# EAGLE design joyAnalog (EAGLE 7.7.0)
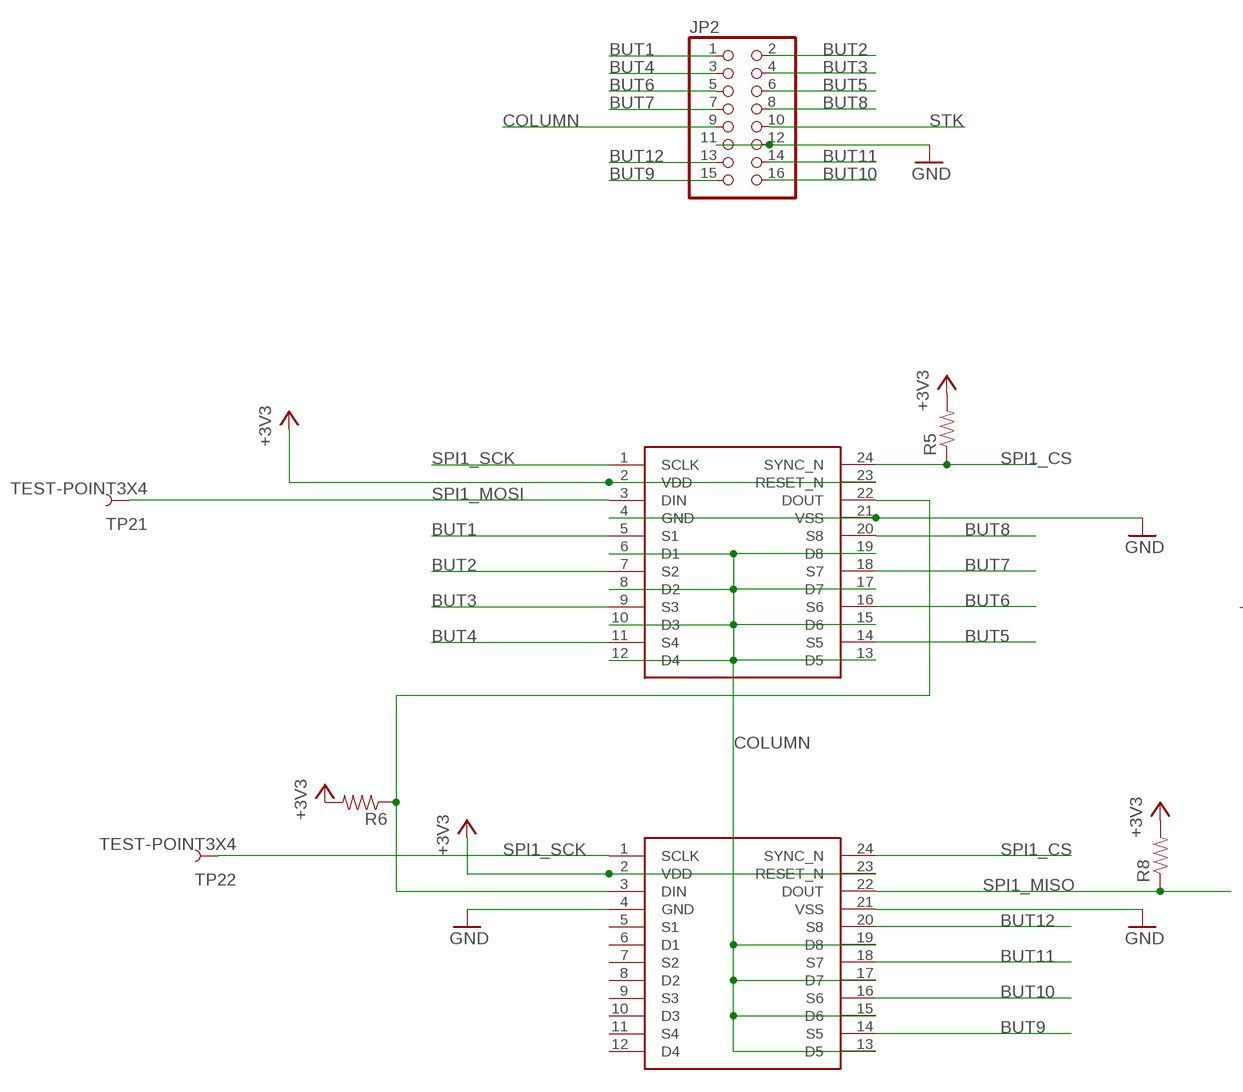
[diagram p0: schematic, sheet 1, part 1 of 2]
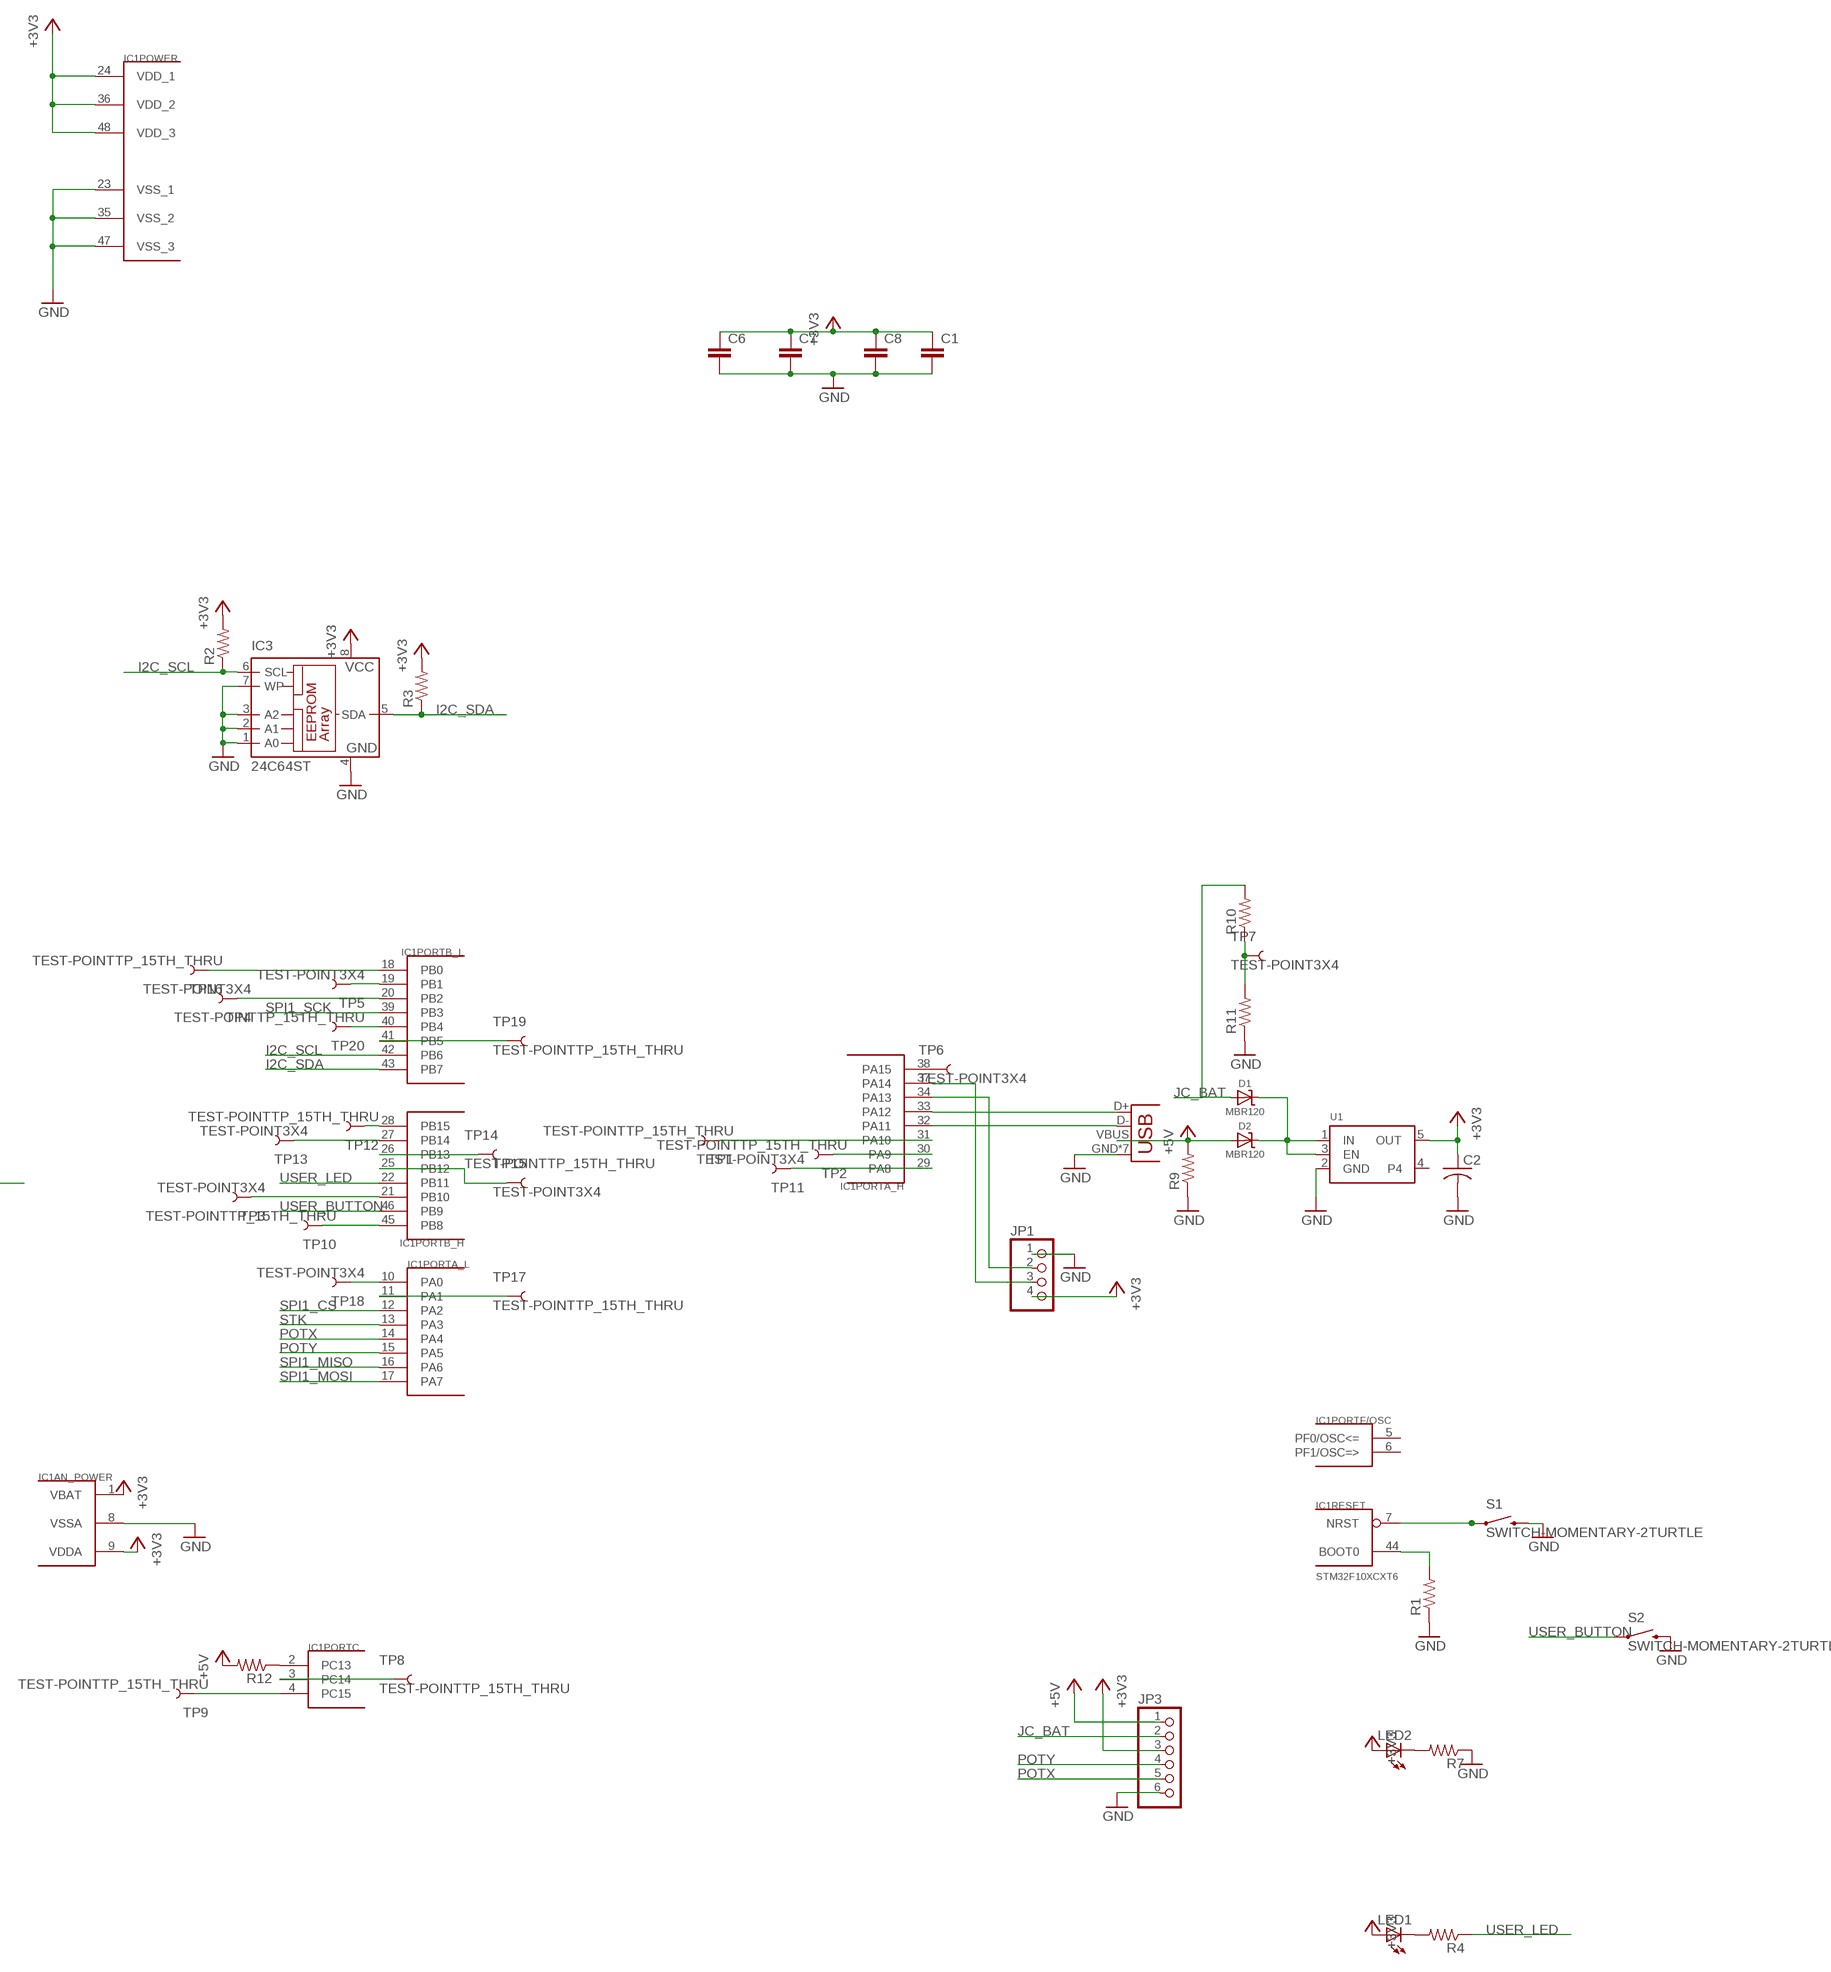
[diagram p1: schematic, sheet 1, part 2 of 2]

## Parts
C1  CAP0805  [0805]
C2  C-USC1210  [C1210]
C6  CAP0805  [0805]
C7  CAP0805  [0805]
C8  CAP0805  [0805]
D1  MBR120  DIODE-SCHOTTKYSOD-123  [SOD-123]
D2  MBR120  DIODE-SCHOTTKYSOD-123  [SOD-123]
IC1  STM32F10XCXT6  [TQFP48]
IC3  24C64ST  [TSSOP8]
JP1  PINHD-1X4  [1X04]
JP2  PINHD-2X8  [2X08]
JP3  PINHD-1X6CB  [1X06-CLEANBIG]
LED1  LEDCHIP-LED0805  [CHIP-LED0805]
LED2  LEDCHIP-LED0805  [CHIP-LED0805]
R1  RESISTOR0805-RES  [0805]
R2  RESISTOR0805-RES  [0805]
R3  RESISTOR0805-RES  [0805]
R4  RESISTOR0805-RES  [0805]
R5  RESISTOR0805-RES  [0805]
R6  RESISTOR0805-RES  [0805]
R7  RESISTOR0805-RES  [0805]
R8  RESISTOR0805-RES  [0805]
R9  RESISTOR0805-RES  [0805]
R10  RESISTOR0805-RES  [0805]
R11  RESISTOR0805-RES  [0805]
R12  RESISTOR0805-RES  [0805]
S1  SWITCH-MOMENTARY-2TURTLE  [KMR2]
S2  SWITCH-MOMENTARY-2TURTLE  [KMR2]
TP1  TEST-POINTTP_15TH_THRU  [TP_15TH]
TP2  TEST-POINTTP_15TH_THRU  [TP_15TH]
TP3  TEST-POINT3X4  [PAD.03X.04]
TP4  TEST-POINT3X4  [PAD.03X.04]
TP5  TEST-POINT3X4  [PAD.03X.04]
TP6  TEST-POINT3X4  [PAD.03X.04]
TP7  TEST-POINT3X4  [PAD.03X.04]
TP8  TEST-POINTTP_15TH_THRU  [TP_15TH]
TP9  TEST-POINTTP_15TH_THRU  [TP_15TH]
TP10  TEST-POINTTP_15TH_THRU  [TP_15TH]
TP11  TEST-POINT3X4  [PAD.03X.04]
TP12  TEST-POINTTP_15TH_THRU  [TP_15TH]
TP13  TEST-POINT3X4  [PAD.03X.04]
TP14  TEST-POINTTP_15TH_THRU  [TP_15TH]
TP15  TEST-POINT3X4  [PAD.03X.04]
TP16  TEST-POINTTP_15TH_THRU  [TP_15TH]
TP17  TEST-POINTTP_15TH_THRU  [TP_15TH]
TP18  TEST-POINT3X4  [PAD.03X.04]
TP19  TEST-POINTTP_15TH_THRU  [TP_15TH]
TP20  TEST-POINTTP_15TH_THRU  [TP_15TH]
TP21  TEST-POINT3X4  [PAD.03X.04]
TP22  TEST-POINT3X4  [PAD.03X.04]
U1  VREG_SOT23-5  [SOT23-5]
U$3  ADG714_DEV  [TSSOP-24]
U$4  ADG714_DEV  [TSSOP-24]
X1  USB-MICROB  [USB-MICROB]

## Nets
+3V3: C1.1 C2.1 C6.1 C7.1 C8.1 IC1.1(AN_POWER:VBAT) IC1.9(AN_POWER:VDDA) IC1.24(POWER:VDD_1) IC1.36(POWER:VDD_2) IC1.48(POWER:VDD_3) IC3.8(VCC) JP1.4 JP3.3 LED1.A LED2.A R2.2 R3.2 R5.2 R6.2 R8.2 U1.5(OUT) U$3.2(VDD) U$3.23(RESET_N) U$4.2(VDD) U$4.23(RESET_N)
+5V: D2.A JP3.1 R9.2 R12.2 X1.VBUS
BUT1: JP2.1 U$3.5(S1)
BUT2: JP2.2 U$3.7(S2)
BUT3: JP2.4 U$3.9(S3)
BUT4: JP2.3 U$3.11(S4)
BUT5: JP2.6 U$3.14(S5)
BUT6: JP2.5 U$3.16(S6)
BUT7: JP2.7 U$3.18(S7)
BUT8: JP2.8 U$3.20(S8)
BUT9: JP2.15 U$4.14(S5)
BUT10: JP2.16 U$4.16(S6)
BUT11: JP2.14 U$4.18(S7)
BUT12: JP2.13 U$4.20(S8)
COLUMN: JP2.9 U$3.6(D1) U$3.8(D2) U$3.10(D3) U$3.12(D4) U$3.13(D5) U$3.15(D6) U$3.17(D7) U$3.19(D8) U$4.13(D5) U$4.15(D6) U$4.17(D7) U$4.19(D8)
GND: C1.2 C2.2 C6.2 C7.2 C8.2 IC1.8(AN_POWER:VSSA) IC1.23(POWER:VSS_1) IC1.35(POWER:VSS_2) IC1.47(POWER:VSS_3) IC3.1(A0) IC3.2(A1) IC3.3(A2) IC3.4(GND) IC3.7(WP) JP1.1 JP2.11 JP2.12 JP3.6 R1.1 R7.1 R9.1 R11.1 S1.3 S2.3 U1.2(GND) U$3.4(GND) U$3.21(VSS) U$4.4(GND) U$4.21(VSS) X1.GND X1.P1(GND) X1.P2(GND) X1.P3(GND) X1.P4(GND) X1.P5(GND) X1.P6(GND)
I2C_SCL: IC1.42(PORTB_L:PB6) IC3.6(SCL) R2.1
I2C_SDA: IC1.43(PORTB_L:PB7) IC3.5(SDA) R3.1
JC_BAT: D1.A JP3.2 R10.2
N$1: IC1.7(RESET:NRST) S1.1
N$2: IC1.44(RESET:BOOT0) R1.2
N$3: LED1.C R4.2
N$4: IC1.33(PORTA_H:PA12) X1.D+
N$5: R6.1 U$3.22(DOUT) U$4.3(DIN)
N$6: IC1.30(PORTA_H:PA9) TP2.P$1
N$7: IC1.32(PORTA_H:PA11) X1.D-
N$8: IC1.34(PORTA_H:PA13) JP1.2
N$9: IC1.37(PORTA_H:PA14) JP1.3
N$10: IC1.31(PORTA_H:PA10) TP1.P$1
N$11: IC1.20(PORTB_L:PB2) TP4.P$1
N$12: IC1.19(PORTB_L:PB1) TP5.P$1
N$13: IC1.21(PORTB_H:PB10) TP3.P$1
N$14: IC1.38(PORTA_H:PA15) TP6.P$1
N$15: R10.1 R11.2 TP7.P$1
N$16: IC1.3(PORTC:PC14) TP8.P$1
N$17: IC1.4(PORTC:PC15) TP9.P$1
N$18: IC1.45(PORTB_H:PB8) TP10.P$1
N$19: IC1.29(PORTA_H:PA8) TP11.P$1
N$20: IC1.28(PORTB_H:PB15) TP12.P$1
N$21: IC1.27(PORTB_H:PB14) TP13.P$1
N$22: IC1.26(PORTB_H:PB13) TP14.P$1
N$23: IC1.25(PORTB_H:PB12) TP15.P$1
N$24: IC1.18(PORTB_L:PB0) TP16.P$1
N$25: IC1.10(PORTA_L:PA0) TP18.P$1
N$26: IC1.11(PORTA_L:PA1) TP17.P$1
N$27: IC1.40(PORTB_L:PB4) TP20.P$1
N$28: IC1.41(PORTB_L:PB5) TP19.P$1
N$29: LED2.C R7.2
N$30: IC1.2(PORTC:PC13) R12.1
N$31: D1.C D2.C U1.1(IN) U1.3(EN)
POTX: IC1.14(PORTA_L:PA4) JP3.5
POTY: IC1.15(PORTA_L:PA5) JP3.4
SPI1_CS: IC1.12(PORTA_L:PA2) R5.1 U$3.24(SYNC_N) U$4.24(SYNC_N)
SPI1_MISO: IC1.16(PORTA_L:PA6) R8.1 U$4.22(DOUT)
SPI1_MOSI: IC1.17(PORTA_L:PA7) TP21.P$1 U$3.3(DIN)
SPI1_SCK: IC1.39(PORTB_L:PB3) TP22.P$1 U$3.1(SCLK) U$4.1(SCLK)
STK: IC1.13(PORTA_L:PA3) JP2.10
USER_BUTTON: IC1.46(PORTB_H:PB9) S2.1
USER_LED: IC1.22(PORTB_H:PB11) R4.1
Unconnected: IC1.5(PORTF/OSC:PF0/OSC<=) IC1.6(PORTF/OSC:PF1/OSC=>) U1.4 U$4.5(S1) U$4.6(D1) U$4.7(S2) U$4.8(D2) U$4.9(S3) U$4.10(D3) U$4.11(S4) U$4.12(D4)

## Library data of the parts
C1 C6-C8 = backplane:CAP: Capacitor Standard 0603 ceramic capacitor, and 0.1" leaded capacitor.
C2 = backplane:C-US: CAPACITOR, American symbol
D1 D2 = microbuilder:DIODE-SCHOTTKY
IC1 = stm32f072c8t6:STM32F10XCXT6: ST STM32F101/103 48pin LQFP
IC3 = microchip:24*: Serial EEPROM I2C; MPN: CAT24C64YI-GT3; OC_FARNELL: 1718133; OC_NEWARK: 08R5418
JP1 = pinhead:PINHD-1X4: PIN HEADER
JP2 = pinheadwerew:PINHD-2X8: PIN HEADER
JP3 = adafruit:PINHD-1X6: PIN HEADER
LED1 LED2 = adafruit:LED: LED OSRAM: - CHIPLED LG R971, LG N971, LY N971, LG Q971, LY Q971, LO R971, LY R971 LH N974, LH R974 LS Q976, LO Q976, LY Q976 LO Q996 - Hyper CHIPLED LW Q18S LB Q993, LB Q99A, LB R99A - SideLED LS A670, LO A670, LY A670, LG A670, LP A670 LB A673, LV A673, LT A673, LW A673 LH A674 LY A675 LS A676, LA A676, LO A676, LY A676, LW A676 LS A679, LY A679, LG A679 - Hyper Micro SIDELED® LS Y876, LA Y876, LO Y876, LY Y876 LT Y87S - SmartLED LW L88C, LW L88S LB L89C, LB L89S, LG L890 LS L89K, LO L89K, LY L89K LS L896, LA L896, LO L896, LY L896 - TOPLED LS T670, LO T670, LY T670, LG T670, LP T670 LSG T670, LSP T670, LSY T670, LOP T670, LYG T670 LG T671, LOG T671, LSG T671 LB T673, LV T673, LT T673, LW T673 LH T674 LS T676, LA T676, LO T676, LY T676, LB T676, LH T676, LSB T676, LW T676 LB T67C, LV T67C, LT T67C, LS T67K, LO T67K, LY T67K, LW E67C LS E67B, LA E67B, LO E67B, LY E67B, LB E67C, LV E67C, LT E67C LW T67C LS T679, LY T679, LG T679 LS T770, LO T770, LY T770, LG T770, LP T770 LB T773, LV T773, LT T773, LW T773 LH T774 LS E675, LA E675, LY E675, LS T675 LS T776, LA T776, LO T776, LY T776, LB T776 LHGB T686 LT T68C, LB T68C - Hyper Mini TOPLED® LB M676 - Mini TOPLED Santana® LG M470 LS M47K, LO M47K, LY M47K Source: http://www.osram.convergy.de/
R1-R12 = SparkFun-Passives:RESISTOR: Resistor Basic schematic elements and footprints for 0603, 1206, and PTH resistors.
S1 S2 = Adafruit Feather M0 Adalogger:SWITCH-MOMENTARY-2: Various NO switches- pushbuttons, reed, etc
TP1 TP2 TP8-TP10 TP12 TP14 TP16 TP17 TP19 TP20 = pth testpoint:TEST-POINT: SparkFun Test Points Bare copper test points for troubleshooting or In-Circuit-Testing. These are used by our Production team for verifying production board runs using pogo-pins on test beds. SparkFun Products: SparkFun LSM9DS1 Breakout <https://www.sparkfun.com/products/13284> SparkFun PSOC <https://www.sparkfun.com/products/13714> SparkFun Load Cell Amplifier <https://www.sparkfun.com/products/13879>
TP3-TP7 TP11 TP13 TP15 TP18 TP21 TP22 = SparkFun-Connectors:TEST-POINT: SparkFun Test Points Bare copper test points for troubleshooting or In-Circuit-Testing. These are used by our Production team for verifying production board runs using pogo-pins on test beds. SparkFun Products: SparkFun LSM9DS1 Breakout <https://www.sparkfun.com/products/13284> SparkFun PSOC <https://www.sparkfun.com/products/13714> SparkFun Load Cell Amplifier <https://www.sparkfun.com/products/13879>
U1 = Adafruit Feather M0 Adalogger:VREG_SOT23-5: SOT23-5 Fixed Voltage Regulators Part Current Out V Out V In V Dropout ?JA (°C/W) TJ (°C) Digikey Part No. ADP121 150mA 3.3V 3.4-5.5V 0.09V @ 150mA -- -- ADP121-AUJZ33R7CT-ND ADP121 150mA 3.0V 3.1-5.5V 0.09V @ 150mA -- -- ADP121-AUJZ30R7CT-ND ADP122 300mA 3.3V 3.4-5.5V 0.085V @ 300mA -- -- ADP122AUJZ-3.3-R7CT-ND ADP1712 300mA 3.3V 3.5-5.5V 0.17V @ 300mA -- -- ADP1712AUJZ-3.3-R7TR-ND AP7311 (Low Cost) 150mA 3.3V 3.5-6V 0.15V @ 150mA -- -- AP7311-33WG-7DICT-ND LD39015M18R 150mA 1.8V 1.9V-5.5V 0.08V @ 100mA -- -- 497-6977-1-ND LP2985A-33DBVR 150mA 3.3V 3.3-16V 0.28V @ 150mA 206 150 296-18479-1-ND MCP1824T-3302E/OT 300mA 3.3V 3.5V-6V 0.2V @ 300mA -- -- MCP1824T-3302E/OTCT-ND MIC5205-2.5YM5 TR 150mA 2.5V 2.7-16V 0.165V @ 150mA -- -- 576-1257-2-ND MIC5205-3.0YM5 TR 150mA 3.0V 3.2V-16V 0.165V @ 150mA -- -- 576-1258-2-ND MIC5205-3.3YM5 TR 150mA 3.3V 3.5V-16V 0.165V @ 150mA -- -- 576-1259-2-ND TPS780330220 150mA 3.3V+2.2V 3.6-5.5V 250mV Max -- -- 296-23332-1-ND TDA3663/N1,135 100mA 3.3V 3.5-45V 0.18V @ 50mA -- -- 568-5343-1-ND Max operating temp can be calculated using ?JA, TJ (max junction temperature), and power in watts. Set the "Maximum Ambient Temperature" until it reaches TJ ("Max Junction Temperature"), which is the absolute limit for safe use of the regulator: Heat Sink Temperature Calculator <http://www.daycounter.com/Calculators/Heat-Sink-Temperature-Calculator.phtml> For example, With 12V source into a 3.3V LP2985 and a 30mA load, we are dissipating (12V-3.3V) * 0.03A = 0.261W. With a ?JA of 206 °C/W, a TJ of 150°C, and 261mW we can safely use the chip without a heat sink up to 75°C (=147.1°C Junction Temperature).
U$3 U$4 = adg714:ADG714_DEV
X1 = backplane:USB: USB Connectors USB-B-PTH is fully proven SKU : PRT-00139/CONN-08278 USB-miniB is fully proven SKU : PRT-00587 USB-A-PCB is untested. USB-A-H is throughly reviewed, but untested. Spark Fun Electronics SKU : PRT-00437 USB-B-SMT is throughly reviewed, but untested. Needs silkscreen touching up. USB-A-S has not been used/tested USB-MB-H has not been used/tested USB-MICROB has been used. CONN-09505; PROD_ID: CONN-09505

## Board
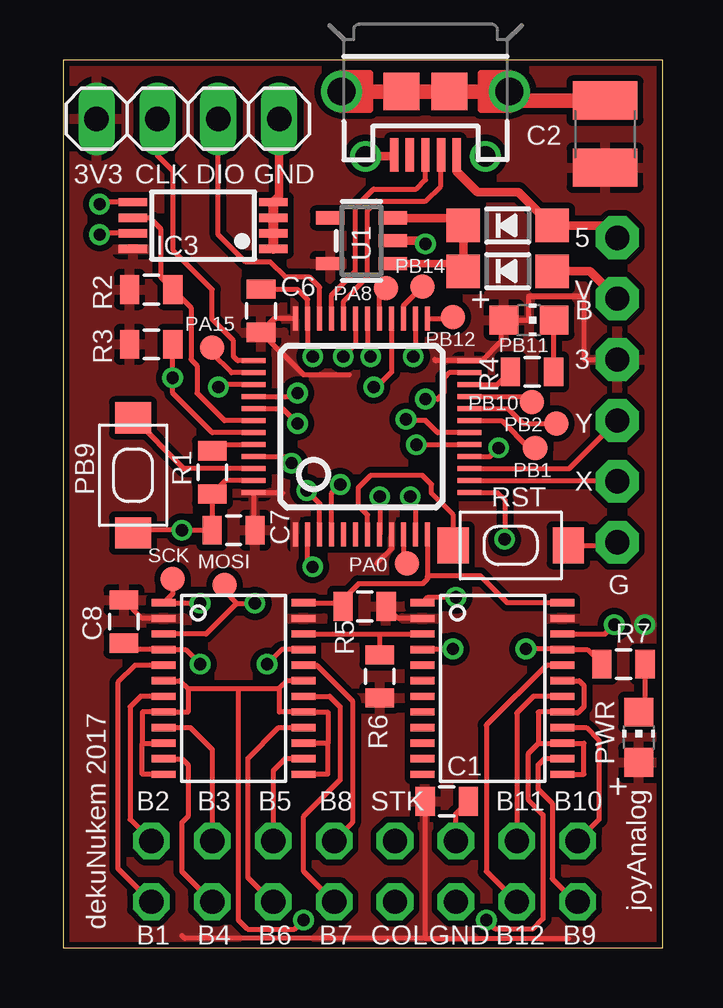
[diagram p2: board, top side]
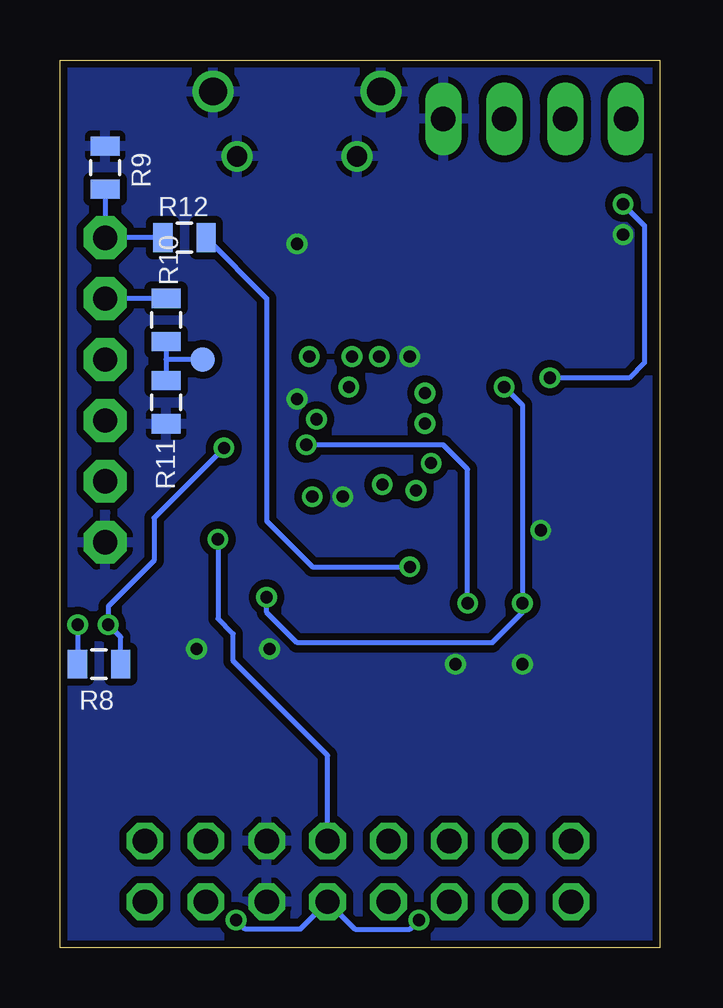
[diagram p3: board, bottom side, seen from below]

Size 25 x 37 mm. Coordinates in mm from the lower left corner, seen from the top.
Outline: 0,0 25,0 25,37 0,37 0,0
Copper layers (1*16): Top 0.035mm / dielectric 1.5mm / Bottom 0.035mm
Design rules "SparkFun-2-layer-TIGHT": minimum track width 7mil, minimum drill 15mil, track to track 7mil, track to pad 7mil, pad to pad 7mil, via to via 7mil, smd to smd 7mil, copper to edge 7mil, drill to drill 7mil, minimum pad ring 7mil, minimum via ring 7mil, stop-mask expansion 4mil, vias tented up to drill 25mil, thermal gap 10mil

### Footprints (pad centres in the part's own frame; a part is rotated, then mirrored left to right if it is on the bottom)
0805 = smd 0.8 x 1.2: 1 -0.9,0; 2 0.9,0
C1210 = smd 1.6 x 2.7: 1 -1.4,0; 2 1.4,0
SOD-123 = smd 1.4 x 1.4: A 1.85,0; C -1.85,0
TQFP48 = smd 0.2 x 1: 1 -2.75,-4.5; 2 -2.25,-4.5; 3 -1.75,-4.5; 4 -1.25,-4.5; 5 -0.75,-4.5; 6 -0.25,-4.5; 7 0.25,-4.5; 8 0.75,-4.5; 9 1.25,-4.5; 10 1.75,-4.5; 11 2.25,-4.5; 12 2.75,-4.5; 25 2.75,4.5; 26 2.25,4.5; 27 1.75,4.5; 28 1.25,4.5; 29 0.75,4.5; 30 0.25,4.5; 31 -0.25,4.5; 32 -0.75,4.5; 33 -1.25,4.5; 34 -1.75,4.5; 35 -2.25,4.5; 36 -2.75,4.5 | smd 1 x 0.2: 13 4.5,-2.75; 14 4.5,-2.25; 15 4.5,-1.75; 16 4.5,-1.25; 17 4.5,-0.75; 18 4.5,-0.25; 19 4.5,0.25; 20 4.5,0.75; 21 4.5,1.25; 22 4.5,1.75; 23 4.5,2.25; 24 4.5,2.75; 37 -4.5,2.75; 38 -4.5,2.25; 39 -4.5,1.75; 40 -4.5,1.25; 41 -4.5,0.75; 42 -4.5,0.25; 43 -4.5,-0.25; 44 -4.5,-0.75; 45 -4.5,-1.25; 46 -4.5,-1.75; 47 -4.5,-2.25; 48 -4.5,-2.75
TSSOP8 = smd 0.35 x 1.2: 1 -0.975,-2.925; 2 -0.325,-2.925; 3 0.325,-2.925; 4 0.975,-2.925; 5 0.975,2.925; 6 0.325,2.925; 7 -0.325,2.925; 8 -0.975,2.925
1X04 = drill 1.016 long: 1 -3.81,0; 2 -1.27,0; 3 1.27,0; 4 3.81,0
2X08 = drill 1.016 octagon: 1 -8.89,-1.27; 2 -8.89,1.27; 3 -6.35,-1.27; 4 -6.35,1.27; 5 -3.81,-1.27; 6 -3.81,1.27; 7 -1.27,-1.27; 8 -1.27,1.27; 9 1.27,-1.27; 10 1.27,1.27; 11 3.81,-1.27; 12 3.81,1.27; 13 6.35,-1.27; 14 6.35,1.27; 15 8.89,-1.27; 16 8.89,1.27
1X06-CLEANBIG = drill 1.016 pad 1.778 octagon: 1 -6.35,0; 2 -3.81,0; 3 -1.27,0; 4 1.27,0; 5 3.81,0; 6 6.35,0
CHIP-LED0805 = smd 1.2 x 1.2: A 0,-1.05; C 0,1.05
KMR2 = smd 1.3 x 1.5: 1 2.4,0; 3 -2.4,0
TP_15TH = drill 0.508 pad 0.813: P$1 0,0
PAD.03X.04 = smd 1.016 x 1.016: P$1 0,0
SOT23-5 = smd 0.55 x 1.2: 1 -0.95,-1.3; 2 0,-1.3; 3 0.95,-1.3; 4 0.95,1.3; 5 -0.95,1.3
TSSOP-24 = smd 0.305 x 0.991: 1 -3.575,-2.918; 2 -2.925,-2.918; 3 -2.275,-2.918; 4 -1.625,-2.918; 5 -0.975,-2.918; 6 -0.325,-2.918; 7 0.325,-2.918; 8 0.975,-2.918; 9 1.625,-2.918; 10 2.275,-2.918; 11 2.925,-2.918; 12 3.575,-2.918; 13 3.575,2.918; 14 2.925,2.918; 15 2.275,2.918; 16 1.625,2.918; 17 0.975,2.918; 18 0.325,2.918; 19 -0.325,2.918; 20 -0.975,2.918; 21 -1.625,2.918; 22 -2.275,2.918; 23 -2.925,2.918; 24 -3.575,2.918
USB-MICROB = smd 0.35 x 1.4: D+ 0,2.65; D- -0.65,2.65; GND 1.3,2.65; ID 0.65,2.65; VBUS -1.3,2.65 | smd 1.5 x 1.55: P1 -1,0; P2 1,0 | drill 1.15 pad 1.422: P3 -3.5,0; P4 3.5,0 | drill 0.85 pad 1.27: P5 -2.5,2.7; P6 2.5,2.7

### Placement (x,y rotation side)
C1  16,6.1 0 top
C2  22.61,33.91 90 top
C6  8.26,26.54 90 top
C7  7.11,17.4 180 top
C8  2.54,13.59 270 top
D1  18.54,28.19 0 top
D2  18.54,30.1 0 top
IC1  12.45,21.72 0 top
IC3  5.84,30.1 90 top
JP1  5.21,34.54 180 top
JP2  12.57,3.17 0 top
JP3  23.11,23.24 270 top
LED1  19.43,26.16 270 top
LED2  24,8.76 0 top
R1  6.22,19.81 90 top
R2  3.68,27.43 180 top
R3  3.68,25.15 180 top
R4  19.56,24 0 top
R5  12.57,14.22 0 top
R6  13.21,11.3 270 top
R7  23.37,11.81 0 top
R8  23.37,11.81 180 bottom
R9  23.11,32.51 270 bottom
R10  20.57,26.16 90 bottom
R11  20.57,22.73 90 bottom
R12  19.81,29.59 180 bottom
S1  18.67,16.76 180 top
S2  2.92,19.68 90 top
TP1  11.68,24.64 0 top
TP2  12.83,24.64 0 top
TP3  19.56,22.73 0 top
TP4  20.57,21.84 0 top
TP5  19.68,20.83 0 top
TP6  6.22,25.02 0 top
TP7  19.05,24.51 0 bottom
TP8  10.16,19.05 0 top
TP9  11.56,19.3 0 top
TP10  9.53,20.19 0 top
TP11  13.46,27.48 0 top
TP12  12.95,23.37 0 top
TP13  14.99,27.56 0 top
TP14  14.61,24.64 0 top
TP15  16.26,26.29 0 top
TP16  14.3,22.02 0 top
TP17  14.48,18.8 0 top
TP18  14.35,16 0 top
TP19  9.78,21.84 0 top
TP20  9.78,23.11 0 top
TP21  6.73,15.11 0 top
TP22  4.57,15.37 0 top
U1  12.45,29.46 90 top
U$3  7.11,10.79 270 top
U$4  17.91,10.79 270 top
X1  15.11,35.69 180 top

### Tracks (layer width: path | path; a pad name or v marks a point on that pad's centre or on a via)
+3V3  (via drill 0.51)
  Top 0.203: C7.1 7.95,17.46 IC1.48 9.14,18.97 9.14,18.92 | U$4.2 13.98,13.72 R5.2 | 18.54,26.16 18.29,25.91 18.29,25.27 17.48,24.47 IC1.24 15.54,24.47 15.49,24.51 | U$3.2 3.31,13.72 C8.1 | LED1.A 19.43,26.16 19.43,27.15 | 21.72,27.15 21.72,24.51 JP3.3 | IC1.9 13.7,16.62 13.08,16 | C1.1 15.1,0.38 | 15.1,0.38 21.08,0.38 | 15.1,0.38 5.08,0.38 4.95,0.51 | IC1.36 8.83,26.22 | C6.1 10.02,23.88 11.94,23.88
  Top 0.254: 19.43,27.15 21.72,27.15 | 8.83,26.22 C6.1
  Bottom 0.203: v24.26,13.46 24.26,11.82 R8.2
  pour Top (isolate 0.254): 0,36.98 25,36.98 25,0 0,0
+5V
  Top 0.356: X1.VBUS 16.41,32.35 17.27,31.5 19,31.5 D2.A 22.61,30.1 JP3.1
  Bottom 0.203: R9.2 JP3.1 R12.2
BUT1
  Top 0.203: U$3.5 3.01,11.77 2.29,11.05 2.29,3.3 JP2.1
BUT2
  Top 0.203: U$3.7 3.23,10.47 2.79,10.03 2.79,5.33 JP2.2
BUT3
  Top 0.203: U$3.9 5.31,9.17 6.22,8.26 JP2.4
BUT4
  Top 0.203: U$3.11 4.96,7.87 5.21,7.62 5.21,5.46 4.95,5.21 4.95,3.17 JP2.3
BUT5
  Top 0.203: U$3.14 9.27,7.87 8.76,7.37 JP2.6
BUT6
  Top 0.203: U$3.16 8.99,9.17 7.7,7.87 7.7,2.92 8.71,1.91 JP2.5
BUT7
  Top 0.203: U$3.18 11.12,10.47 11.56,10.03 11.56,6.99 10.03,5.46 10.03,3.17 JP2.7
BUT8
  Top 0.203: U$3.20 10.58,11.77 12.06,10.29 12.06,5.21 JP2.8
BUT9
  Top 0.203: U$4.14 20.06,7.87 19.81,7.62 19.81,6.6 20.4,6.02 20.4,2.87 21.36,1.91 JP2.15
BUT10
  Top 0.203: U$4.16 21.82,9.17 22.35,8.64 22.35,5.33 JP2.16
BUT11
  Top 0.203: U$4.18 19.61,10.47 18.92,9.78 JP2.14
BUT12
  Top 0.203: U$4.20 20.15,11.77 17.65,9.27 17.65,3.17 JP2.13
COLUMN  (via drill 0.51)
  Top 0.203: 4.19,7.24 U$3.12 3.3,7.22 3.3,8.51 | U$3.13 10.03,7.24 11.05,7.24 11.05,8.51 | 3.3,8.51 3.3,9.82 U$3.8 5.21,9.82 5.21,10.79 | 3.3,8.51 U$3.10 | 11.05,8.51 11.05,9.82 U$3.17 9.02,9.82 9.02,10.79 | 11.05,8.51 U$3.15 | U$4.13 21.72,7.22 21.72,8.52 U$4.15 19.81,8.51 | U$4.17 19.81,9.82 19.81,8.51 | 20.82,9.78 U$4.17 | U$4.19 21.52,11.12 21.72,10.92 21.72,10.03 21.46,9.78 20.87,9.78 U$4.17 | 19.81,8.51 19.41,8.1 19.41,6.15 20.02,5.54 20.02,1.19 19.58,0.76 18.03,0.76 v17.65,1.14 | v10.03,1.14 9.65,0.76 7.7,0.76 7.32,1.14 7.32,10.74 7.37,10.79 | U$3.6 4.88,11.12 5.21,10.79 | U$3.19 9.34,11.12 9.02,10.79 | 5.21,10.79 7.37,10.79 | 7.37,10.79 9.02,10.79
  Bottom 0.203: 13.72,1.91 JP2.9 | 13.97,1.91 JP2.9 | JP2.9 12.7,0.76 10.41,0.76 v10.03,1.14 | JP2.9 14.99,0.76 17.27,0.76 v17.65,1.14
GND  (via drill 0.51)
  Top 0.203: IC3.7 1.58,29.77 v1.52,29.72 | U$4.4 15.02,12.45 v16.26,12.45 | IC1.47 6.78,19.47 R1.1 6.22,17.41 C7.2 v4.95,17.4 3.04,17.4 S2.3 | v19.3,12.45 20.8,12.45 U$4.21 21.86,12.42 R7.1 | S1.3 22.99,16.76 JP3.6 | v13.21,18.8 IC1.8 | JP2.12 16.38,5.58 C1.2 | C8.2 2.81,12.42 U$3.4 5.11,12.42 v5.71,11.81 | v10.41,24.64 10.2,24.86 IC1.35 10.2,27.02 9.78,27.43 C6.2 | IC1.23 16.09,23.97 15.88,23.75 15.88,23.11 15.62,22.86 v15.11,22.86 | U$3.21 9.12,12.42 v8.51,11.81
  Top 0.356: U1.2 14.99,29.46 v15.11,29.34 | JP1.1 9.02,31.32 IC3.4 | X1.P6 13.76,32.99 X1.GND
  Top 0.406: IC3.4 IC3.3 IC3.2 IC3.1
  Top 0.61: X1.P4 X1.P2 X1.P1 X1.P3 18.99,35.31 C2.2
  pour Bottom (isolate 0.305): 0,36.98 25,36.98 25,0 0,0
I2C_SCL
  Top 0.203: 4.57,27.44 R2.1 | IC1.42 6.74,21.97 5.59,23.11 5.59,24.26 5.33,24.51 5.33,26.67 R2.1 | IC3.6 3.61,30.42 4.06,29.97 4.06,27.95 R2.1
I2C_SDA  (via drill 0.51)
  Top 0.203: IC3.5 1.61,31.07 v1.52,30.99 | R3.1 4.57,25.14 v4.57,23.75 4.57,23.11 6.22,21.47 IC1.43
  Bottom 0.203: v1.52,30.99 0.64,30.1 0.64,24.38 1.27,23.75 v4.57,23.75
JC_BAT
  Top 0.356: D1.A 21.97,28.19 JP3.2
  Bottom 0.203: R10.2 20.59,27.05 JP3.2
N$1
  Top 0.203: IC1.7 12.7,18.04 12.32,18.41 12.32,19.18 12.83,19.68 14.99,19.68 15.37,19.3 15.37,18.92 16.27,18.02 S1.1
N$2
  Top 0.203: R1.2 6.48,20.97 IC1.44
N$3
  Top 0.203: R4.2 20.46,26.14 LED1.C
N$4
  Top 0.203: X1.D+ 15.11,32 14.73,31.62 12.95,31.62 12.19,30.86 12.19,28.19 11.2,27.2 IC1.33
N$5
  Top 0.203: U$3.22 13.21,13.07 | 13.21,13.07 U$4.3 | R6.1 13.21,13.07
N$6
  Top 0.203: IC1.30 12.7,24.77 TP2.P$1
N$7
  Top 0.203: X1.D- 15.75,33.02 15.75,31.75 15.11,31.11 13.08,31.11 12.7,30.73 12.7,27.94 11.7,26.94 IC1.32
N$8
  Top 0.203: IC1.34 10.7,27.53 10.29,27.94 9.27,27.94 8.64,28.57 7.62,28.57 6.48,29.72 JP1.2
N$9
  Top 0.203: JP1.3 3.94,33.02 4.57,32.38 4.57,29.08 6.22,27.43 6.22,26.19 7.11,25.3 7.11,24.64 7.28,24.47 IC1.37
N$10
  Top 0.203: IC1.31 12.2,25.15 TP1.P$1
N$11
  Top 0.203: IC1.20 18.55,22.47 19.18,21.84 TP4.P$1
N$12
  Top 0.203: IC1.19 18.29,21.97 19.43,20.83 TP5.P$1
N$13
  Top 0.203: IC1.21 19.32,22.97 TP3.P$1
N$14
  Top 0.203: IC1.38 7.02,23.97 6.22,24.77 TP6.P$1
N$15
  Bottom 0.203: R10.1 20.57,24.51 | 20.57,24.51 R11.2 | TP7.P$1 20.57,24.51
N$16
  Top 0.203: IC1.3 10.7,18.51 TP8.P$1
N$17
  Top 0.203: IC1.4 11.2,18.94 TP9.P$1
N$18
  Top 0.203: IC1.45 9.25,20.47 TP10.P$1
N$19
  Top 0.203: IC1.29 13.2,27.22 TP11.P$1
N$20
  Top 0.203: IC1.28 13.7,23.98 13.08,23.37 TP12.P$1
N$21
  Top 0.203: IC1.27 14.2,26.77 TP13.P$1
N$22
  Top 0.203: IC1.26 14.7,24.73 TP14.P$1
N$23
  Top 0.203: IC1.25 16.18,26.22 TP15.P$1
N$24
  Top 0.203: IC1.18 15.62,21.47 15.11,21.97 14.35,21.97 TP16.P$1
N$25
  Top 0.203: IC1.10 14.2,16.16 TP18.P$1
N$26
  Top 0.203: TP17.P$1 14.7,18.58 IC1.11
N$27
  Top 0.203: IC1.40 9.63,22.97 TP20.P$1
N$28
  Top 0.203: IC1.41 9.16,22.47 TP19.P$1
N$29
  Top 0.203: R7.2 24.27,10.08 LED2.C
N$30  (via drill 0.5)
  Top 0.203: v10.41,15.88 10.2,16.09 IC1.2
  Bottom 0.203: R12.1 16.38,27.06 16.38,17.78 14.48,15.88 v10.41,15.88
N$31
  Top 0.305: U1.1 16.37,28.51 D1.C
  Top 0.356: D1.C D2.C 16.38,30.41 U1.3
POTX
  Top 0.203: IC1.14 23.08,19.47 JP3.5
POTY
  Top 0.203: IC1.15 21.11,19.97 JP3.4
SPI1_CS
  Top 0.203: U$3.24 11.53,14.37 R5.1 11.67,14.52 12.32,15.16 14.99,15.16 15.2,15.37 15.2,15.49 | U$4.24 18.52,14.37 17.4,15.49 15.2,15.49 | IC1.12 15.2,15.49
SPI1_MISO  (via drill 0.51)
  Top 0.203: IC1.16 17.8,20.47 v18.16,20.83 | U$4.22 22.59,13.07 v22.99,13.46
  Bottom 0.203: v18.16,20.83 21.08,17.91 21.08,16.13 22.99,14.22 v22.99,13.46 22.47,12.94 R8.1
SPI1_MOSI  (via drill 0.51)
  Top 0.203: U$3.3 5.96,13.07 7.24,14.35 | v14.73,20.95 14.74,20.97 IC1.17 | 7.24,14.35 v8,14.35 | TP21.P$1 6.73,14.86 7.24,14.35
  Bottom 0.203: v8,14.35 8,19.94 9.02,20.95 v14.73,20.95
SPI1_SCK  (via drill 0.51)
  Top 0.203: IC1.39 6.58,23.47 v6.48,23.37 | v5.71,14.35 5.7,14.37 U$3.1 4.57,14.75 TP22.P$1 | U$4.1 15.22,14.61 v16.38,14.61
  Bottom 0.203: v16.38,14.61 16.38,13.97 15.11,12.7 6.99,12.7 5.71,13.97 v5.71,14.35 5.71,22.61 v6.48,23.37
STK  (via drill 0.51)
  Top 0.203: IC1.13 18.12,18.97 18.41,18.67 v18.41,17.02
  Bottom 0.203: JP2.10 13.84,8 17.78,11.94 17.78,13.08 18.41,13.72 v18.41,17.02
USER_BUTTON
  Top 0.203: IC1.46 5.04,19.97 S2.1
USER_LED
  Top 0.203: IC1.22 18.12,23.47 R4.1

### Text on the board
tNames: 3V3 | CLK | DIO | GND | PB14 | 5 | PA8 | PA15 | PB12 | V / B | PB11 | 3 | PB10 | PB2 | Y | PB1 | PB9 | X | RST | SCK | MOSI | PA0 | G | PWR | joyAnalog | B2 | B3 | B5 | B8 | STK | B11 | B10 | dekuNukem 2017 | B1 | B4 | B6 | B7 | COL | GND | B12 | B9